# Altium schematic sheet lab3_microprocessor.SchDoc
size A4; Author: Michał Wojna; CompanyName: AGH; Revision: 1; SheetNumber: 3; SheetTotal: 2
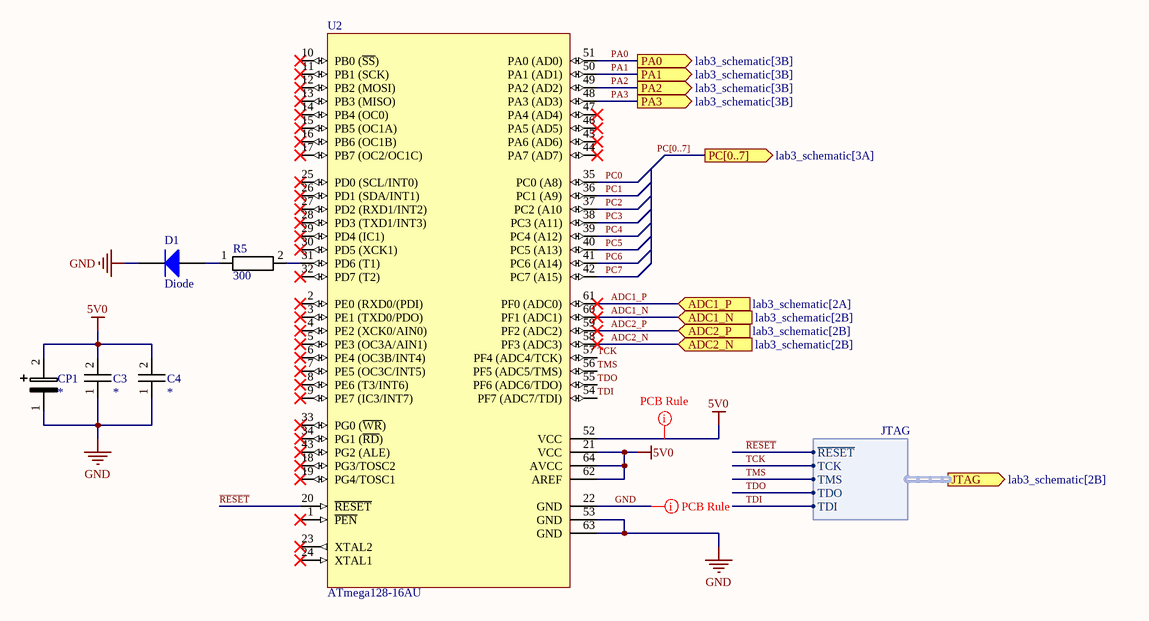
[diagram p0: lab3_microprocessor.SchDoc]

## Parts
C3  *  [0805_STD]
C4  *  [0805_STD]
CP1  *  [VJ_Tantalum_D]
D1  Diode  [SMC]
R5  300  [0603]
U2  ATmega128-16AU  [64A_M]

## Ports
ADC1_N (in, see lab3_schematic[2B]), ADC1_P (in, see lab3_schematic[2A]), ADC2_N (in, see lab3_schematic[2B]), ADC2_P (in, see lab3_schematic[2B]), JTAG (out, harness JTAG, see lab3_schematic[2B]), PA0 (out, see lab3_schematic[3B]), PA1 (out, see lab3_schematic[3B]), PA2 (out, see lab3_schematic[3B]), PA3 (out, see lab3_schematic[3B]), PC[0..7] (out, see lab3_schematic[3A])

## Harnesses
JTAG: ~{RESET}, TCK, TMS, TDO, TDI

## Nets
5V0: C3.2(PIN) C4.2(PIN) CP1.2(PIN) U2.21(VCC) U2.52(VCC) U2.62(AREF) U2.64(AVCC)
GND: C3.1(PIN) C4.1(PIN) CP1.1(PIN) D1.2(K) U2.22(GND) U2.53(GND) U2.63(GND)
~{RESET}: U2.20(~{RESET}) ; port JTAG.~{RESET}
ADC1_N: U2.60(PF1_(ADC1)) ; port ADC1_N
ADC1_P: U2.61(PF0_(ADC0)) ; port ADC1_P
ADC2_N: U2.58(PF3_(ADC3)) ; port ADC2_N
ADC2_P: U2.59(PF2_(ADC2)) ; port ADC2_P
PA0: U2.51(PA0_(AD0)) ; port PA0
PA1: U2.50(PA1_(AD1)) ; port PA1
PA2: U2.49(PA2_(AD2)) ; port PA2
PA3: U2.48(PA3_(AD3)) ; port PA3
PC0: U2.35(PC0_(A8))
PC1: U2.36(PC1_(A9))
PC2: U2.37(PC2_(A10)
PC3: U2.38(PC3_(A11))
PC4: U2.39(PC4_(A12))
PC5: U2.40(PC5_(A13))
PC6: U2.41(PC6_(A14))
PC7: U2.42(PC7_(A15))
TCK: U2.57(PF4_(ADC4/TCK)) ; port JTAG.TCK
TDI: U2.54(PF7_(ADC7/TDI)) ; port JTAG.TDI
TDO: U2.55(PF6_(ADC6/TDO)) ; port JTAG.TDO
TMS: U2.56(PF5_(ADC5/TMS)) ; port JTAG.TMS
NetD1_1: D1.1(A) R5.1(PIN)
NetR5_2: R5.2(PIN) U2.31(PD6_(T1))

Not connected (* = marked no-connect by the designer): U2 1(~{PEN})* 2(PE0_(RXD0/(PDI))* 3(PE1_(TXD0/PDO))* 4(PE2_(XCK0/AIN0))* 5(PE3_(OC3A/AIN1))* 6(PE4_(OC3B/INT4))* 7(PE5_(OC3C/INT5))* 8(PE6_(T3/INT6))* 9(PE7_(IC3/INT7))* 10(PB0_(~{SS}))* 11(PB1_(SCK))* 12(PB2_(MOSI))* 13(PB3_(MISO))* 14(PB4_(OC0))* 15(PB5_(OC1A))* 16(PB6_(OC1B))* 17(PB7_(OC2/OC1C))* 18(PG3/TOSC2)* 19(PG4/TOSC1)* 23(XTAL2)* 24(XTAL1)* 25(PD0_(SCL/INT0))* 26(PD1_(SDA/INT1))* 27(PD2_(RXD1/INT2))* 28(PD3_(TXD1/INT3))* 29(PD4_(IC1))* 30(PD5_(XCK1))* 32(PD7_(T2))* 33(PG0_(~{WR}))* 34(PG1_(~{RD}))* 43(PG2_(ALE))* 44(PA7_(AD7))* 45(PA6_(AD6))* 46(PA5_(AD5))* 47(PA4_(AD4))*

## Buses and harness runs
bus PC[0..7] = port PC[0..7]

## Layout directives
rule Width Constraint [Pref Width = 20mil    Min Width = 15mil    Max Width = 50mil]: 5V0, GND

## Notes on the sheet
- Company Confidenrial / Not for distribution!
- Project name:
- Document Name:
- Designer Name:
- Date / Time:
- Revision:

## Library data of the parts
C3 C4 = Capacitor: Manufacturer: *; Part Number: *; Value: *
CP1 = Capacitor_polarized: Manufacturer: *; Part Number: *; Value: *
D1 = Diode: Default Diode; Published: 8-Jun-2000; LatestRevisionDate: 17-Jul-2002; LatestRevisionNote: Re-released for DXP Platform.; PackageVersion: Sep-1996; PackageReference: SMC; Publisher: Altium Limited; PackageDescription: DO-214-AB/SMC; 2 C-Bend Leads; Body 7.9 x 5.9 mm, inc. leads (LxW); Code_JEDEC: DO-214-AB
R5 = Resistor: Manufacturer: *; Part Number: *; Value: 300
U2 = CMP-0095-00259-2: 8-bit AVR Microcontroller, 4.5-5.5V, 128KB Flash, 4KB EEPROM, 4KB SRAM, 64-pin TQFP, Industrial Grade (-40°C to 85°C); ComponentLink3URL: http://www.atmel.com/dyn/resources/prod_documents/2467S.pdf; PackageVersion: revC, Oct-2010; ComponentLink2URL: http://www.atmel.com/dyn/resources/prod_documents/doc2467.pdf; ComponentLink2Description: ATmega128(L) Datasheet; ComponentLink1Description: Manufacturer URL; PackageReference: 64A; DatasheetVersion: revX, Jun-2011; ComponentLink3Description: ATmega128(L) Summary; ComponentLink1URL: http://www.atmel.com/; RevisionNote: PackageVersion updated. URLs added.; Code_JEDEC: MS-026-AEB; PackageDescription: 64-Pin Plastic Thin Profile Quad Flat Pack, 14 x 14 x 1.0 mm Body, 0.8 mm Pitch (TQFP)